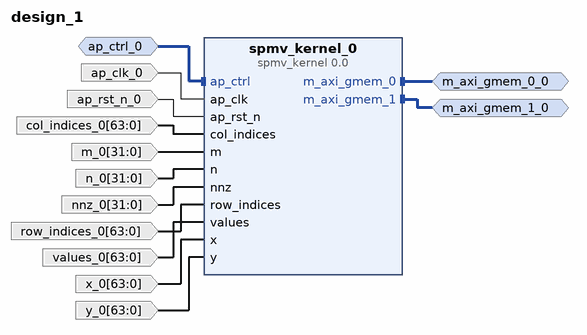
[diagram p0: block diagram of the top level]
# Vivado block design design_1, xc7z020clg400-1, Vivado 2020.1
create_bd_design design_1

create_bd_intf_port -mode Slave -vlnv xilinx.com:interface:acc_handshake_rtl:1.0 ap_ctrl_0
create_bd_intf_port -mode Master -vlnv xilinx.com:interface:aximm_rtl:1.0 m_axi_gmem_0_0
set_property -dict [list \
  CONFIG.DATA_WIDTH 32 \
  CONFIG.PROTOCOL AXI4 \
  CONFIG.ADDR_WIDTH 64 \
  CONFIG.HAS_BURST 0 \
  CONFIG.NUM_READ_OUTSTANDING 16 \
  CONFIG.NUM_WRITE_OUTSTANDING 16 \
] [get_bd_intf_ports m_axi_gmem_0_0]
create_bd_intf_port -mode Master -vlnv xilinx.com:interface:aximm_rtl:1.0 m_axi_gmem_1_0
set_property -dict [list \
  CONFIG.DATA_WIDTH 32 \
  CONFIG.PROTOCOL AXI4 \
  CONFIG.ADDR_WIDTH 64 \
  CONFIG.HAS_BURST 0 \
  CONFIG.NUM_READ_OUTSTANDING 16 \
  CONFIG.NUM_WRITE_OUTSTANDING 16 \
] [get_bd_intf_ports m_axi_gmem_1_0]
create_bd_port -dir I -type clk ap_clk_0
create_bd_port -dir I -type rst ap_rst_n_0
create_bd_port -dir I -from 63 -to 0 -type data col_indices_0
create_bd_port -dir I -from 31 -to 0 -type data m_0
create_bd_port -dir I -from 31 -to 0 -type data n_0
create_bd_port -dir I -from 31 -to 0 -type data nnz_0
create_bd_port -dir I -from 63 -to 0 -type data row_indices_0
create_bd_port -dir I -from 63 -to 0 -type data values_0
create_bd_port -dir I -from 63 -to 0 -type data x_0
create_bd_port -dir I -from 63 -to 0 -type data y_0

create_bd_cell -type ip -vlnv xilinx.com:hls:spmv_kernel:0.0 spmv_kernel_0

# ---- connections ----

connect_bd_intf_net [get_bd_intf_ports m_axi_gmem_0_0] [get_bd_intf_pins spmv_kernel_0/m_axi_gmem_0]
connect_bd_intf_net -intf_net ap_ctrl_0_1 [get_bd_intf_ports ap_ctrl_0] [get_bd_intf_pins spmv_kernel_0/ap_ctrl]
connect_bd_intf_net [get_bd_intf_ports m_axi_gmem_1_0] [get_bd_intf_pins spmv_kernel_0/m_axi_gmem_1]
connect_bd_net -net ap_clk_0_1 [get_bd_ports ap_clk_0] [get_bd_pins spmv_kernel_0/ap_clk]
connect_bd_net -net ap_rst_n_0_1 [get_bd_ports ap_rst_n_0] [get_bd_pins spmv_kernel_0/ap_rst_n]
connect_bd_net -net col_indices_0_1 [get_bd_ports col_indices_0] [get_bd_pins spmv_kernel_0/col_indices]
connect_bd_net -net m_0_1 [get_bd_ports m_0] [get_bd_pins spmv_kernel_0/m]
connect_bd_net -net n_0_1 [get_bd_ports n_0] [get_bd_pins spmv_kernel_0/n]
connect_bd_net -net nnz_0_1 [get_bd_ports nnz_0] [get_bd_pins spmv_kernel_0/nnz]
connect_bd_net -net row_indices_0_1 [get_bd_ports row_indices_0] [get_bd_pins spmv_kernel_0/row_indices]
connect_bd_net -net values_0_1 [get_bd_ports values_0] [get_bd_pins spmv_kernel_0/values]
connect_bd_net -net x_0_1 [get_bd_ports x_0] [get_bd_pins spmv_kernel_0/x]
connect_bd_net -net y_0_1 [get_bd_ports y_0] [get_bd_pins spmv_kernel_0/y]

validate_bd_design
save_bd_design
